# EAGLE schematic Patriot_78421-B (EAGLE 5.11)
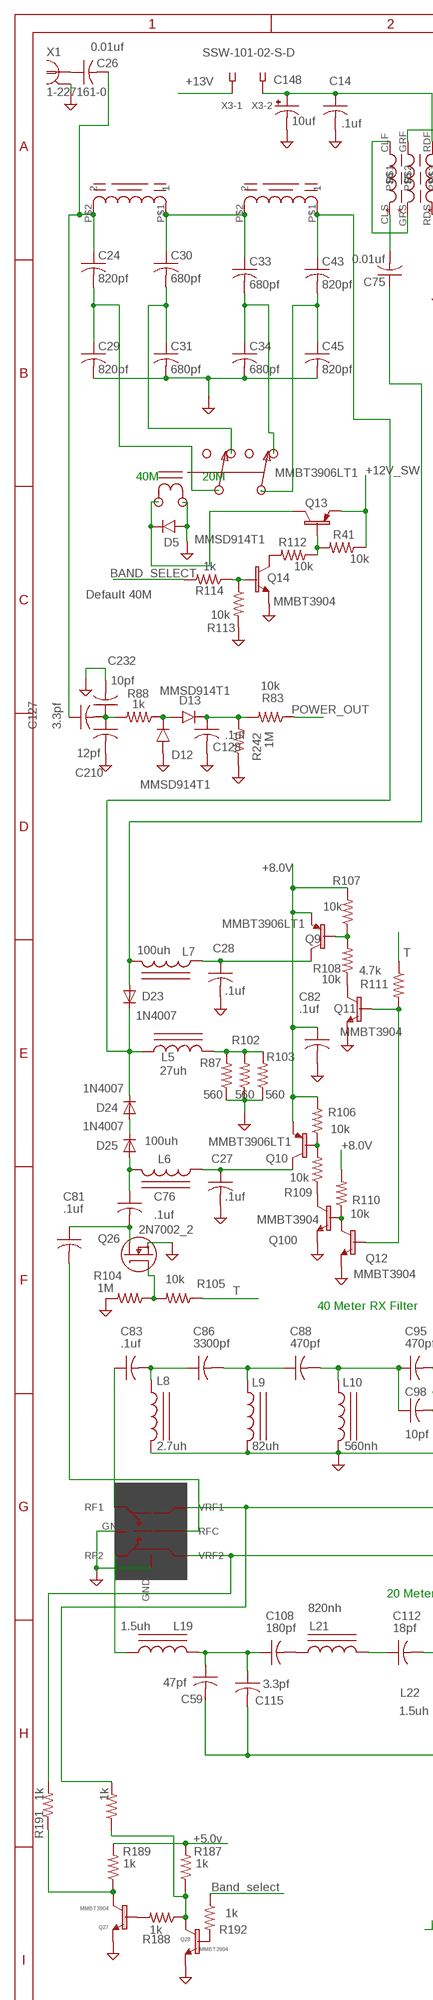
[diagram p0: schematic, sheet 1, part 1 of 2]
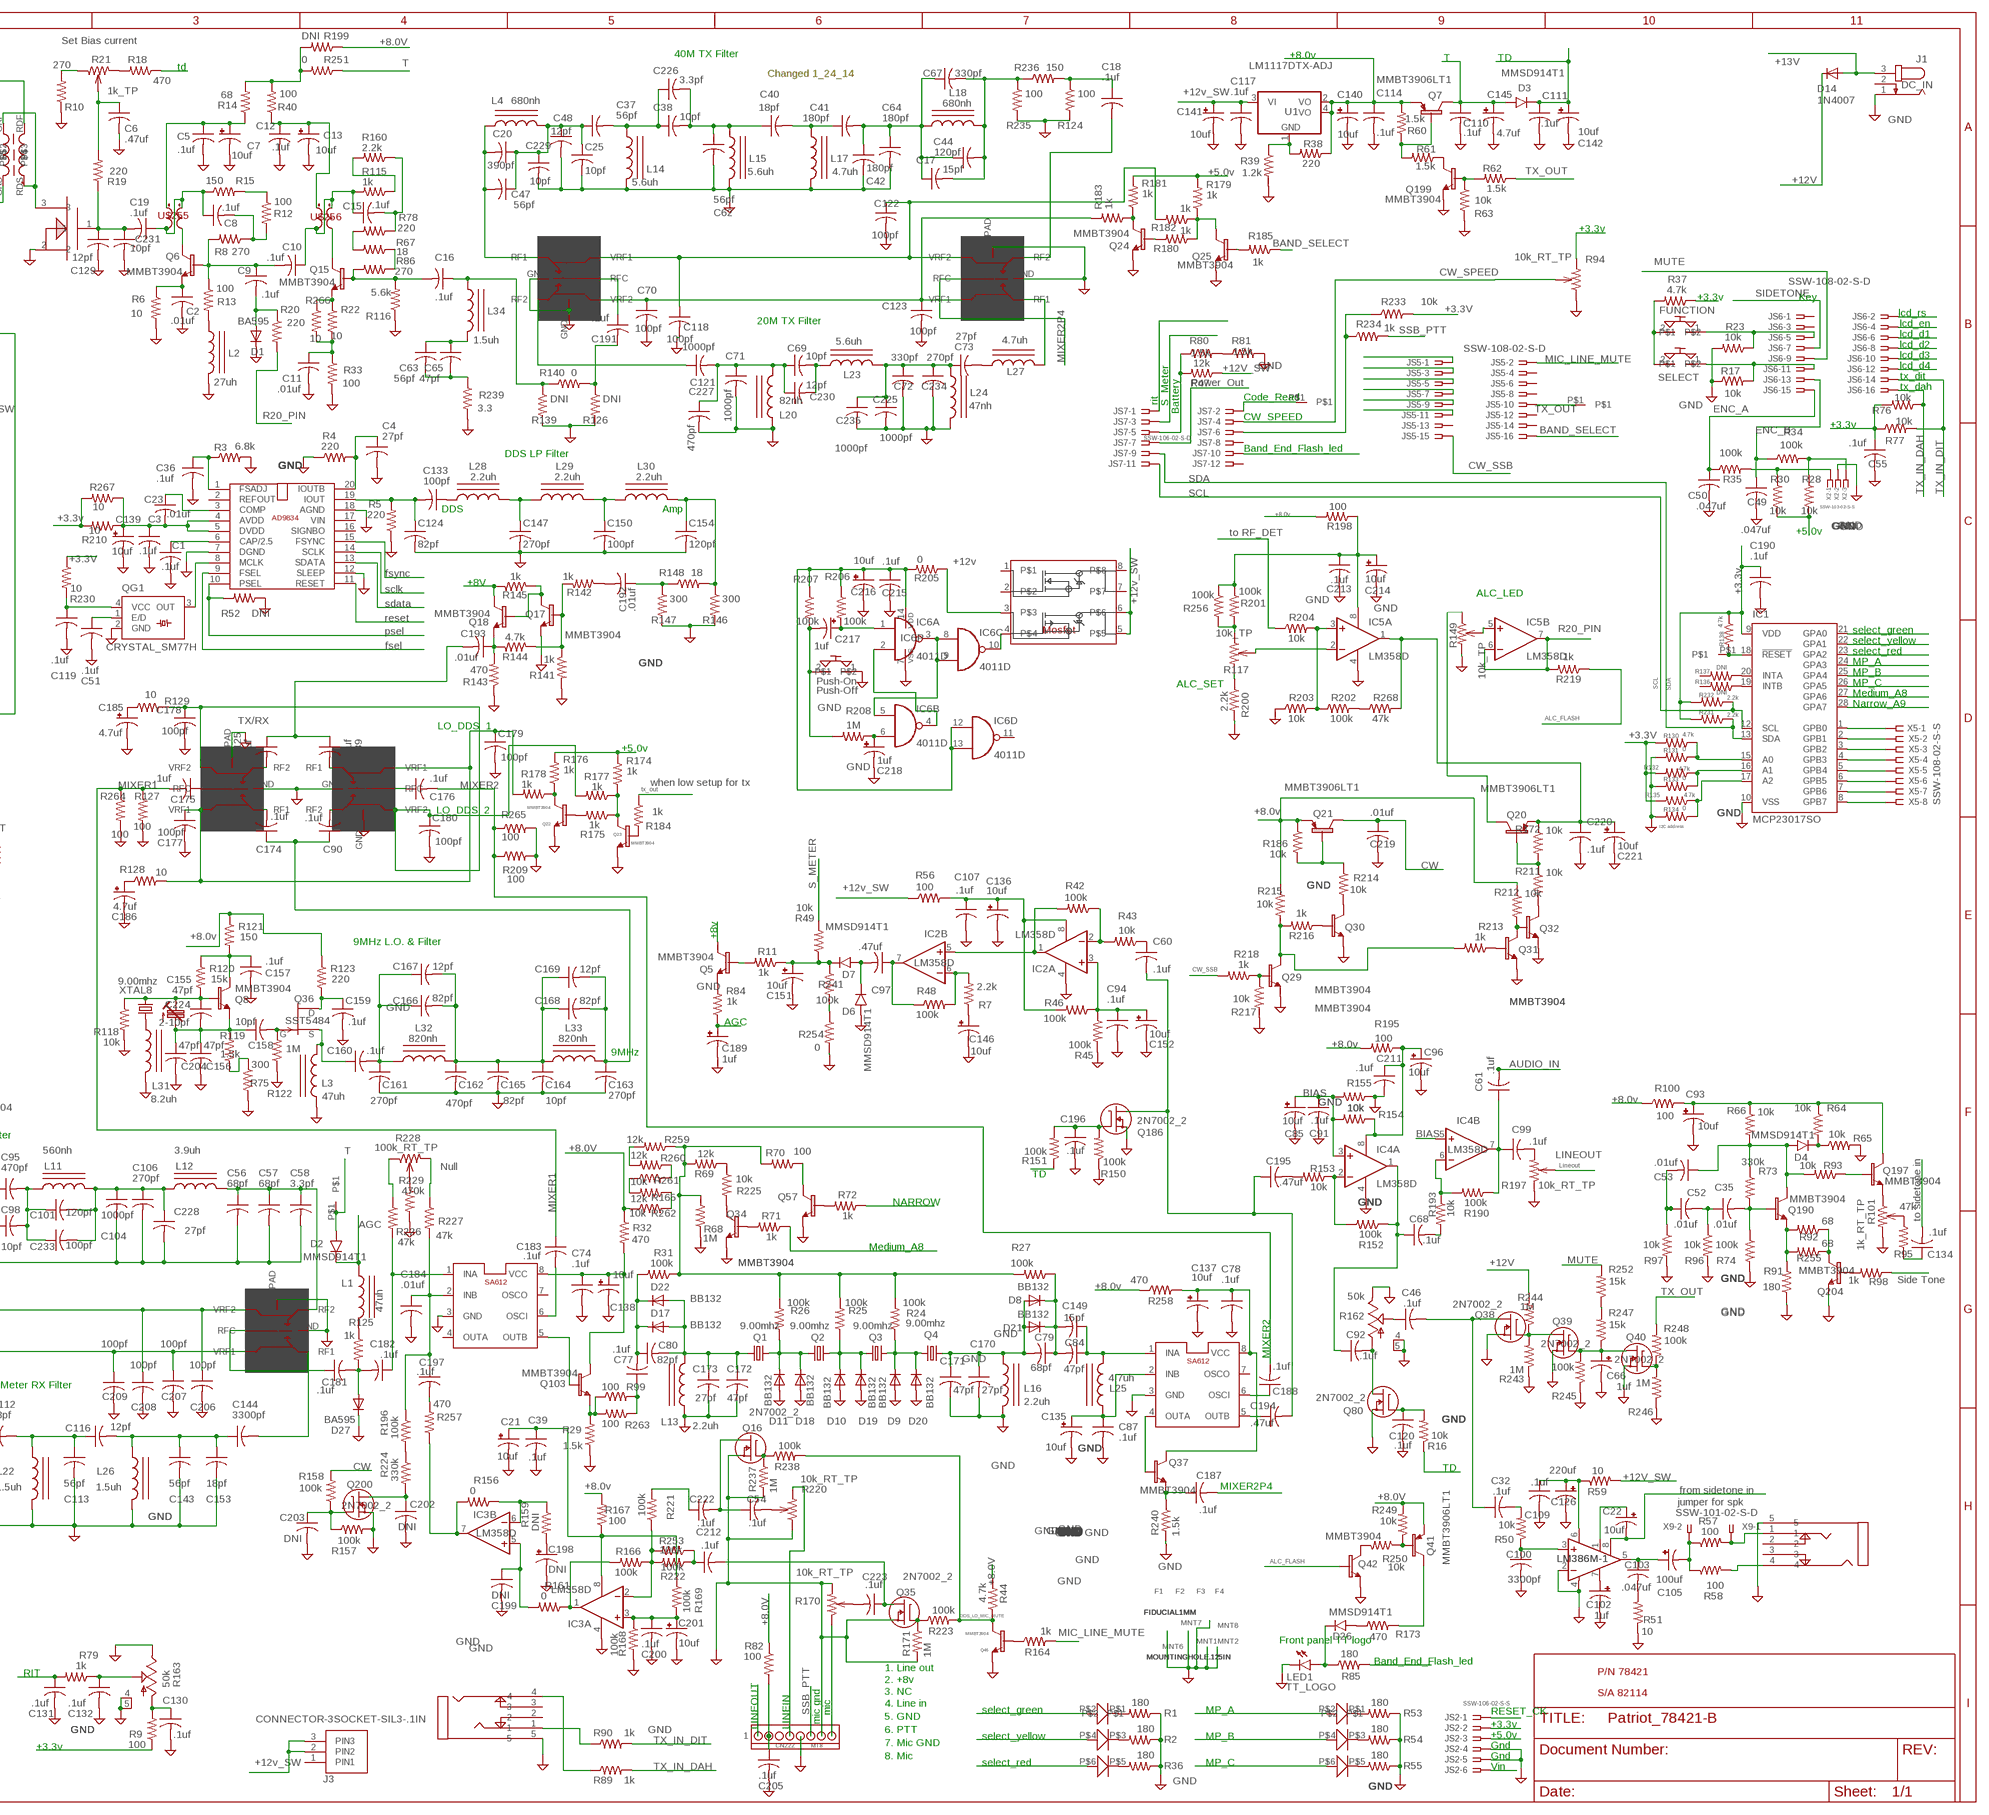
[diagram p1: schematic, sheet 1, part 2 of 2]

## Parts
C1  .1uf  CAP0603  [0603]
C2  .01uf  CAP0603  [0603]
C3  .1uf  CAP0603  [0603]
C4  27pf  CAP0603  [0603]
C5  .1uf  CAP0603  [0603]
C6  .47uf  CAP0805  [0805]
C7  10uf  CPOL-USSMCA  [SMC_A]
C8  .1uf  CAP0603  [0603]
C9  .1uf  CAP0603  [0603]
C10  .1uf  CAP0603  [0603]
C11  .01uf  CAP0603  [0603]
C12  .1uf  CAP0603  [0603]
C13  10uf  CPOL-USSMCA  [SMC_A]
C14  .1uf  CAP0603  [0603]
C15  .1uf  CAP0603  [0603]
C16  .1uf  CAP0603  [0603]
C17  15pf  CAP0805  [0805]
C18  .1uf  CAP0603  [0603]
C19  .1uf  CAP0603  [0603]
C20  390pf  CAP0603  [0603]
C21  10uf  CPOL-USSMCA  [SMC_A]
C22  10uf  CPOL-USSMCA  [SMC_A]
C23  .01uf  CAP0603  [0603]
C24  820pf  C-USC1206K  [C1206K]
C25  10pf  CAP0603  [0603]
C26  0.01uf  C-USC1206K  [C1206K]
C27  .1uf  CAP0603  [0603]
C28  .1uf  CAP0603  [0603]
C29  820pf  C-USC1206K  [C1206K]
C30  680pf  C-USC1206K  [C1206K]
C31  680pf  C-USC1206K  [C1206K]
C32  .1uf  CAP0603  [0603]
C33  680pf  C-USC1206K  [C1206K]
C34  680pf  C-USC1206K  [C1206K]
C35  .01uf  CAP0603  [0603]
C36  .1uf  CAP0603  [0603]
C37  56pf  CAP0603  [0603]
C38  10pf  CAP0603  [0603]
C39  .1uf  CAP0603  [0603]
C40  18pf  CAP0603  [0603]
C41  180pf  CAP0603  [0603]
C42  180pf  CAP0603  [0603]
C43  820pf  C-USC1206K  [C1206K]
C44  120pf  CAP0603  [0603]
C45  820pf  C-USC1206K  [C1206K]
C46  .1uf  CAP0603  [0603]
C47  56pf  CAP0603  [0603]
C48  12pf  CAP0603  [0603]
C49  .047uf  CAP0603  [0603]
C50  .047uf  CAP0603  [0603]
C51  .1uf  CAP0603  [0603]
C52  .01uf  CAP0603  [0603]
C53  .01uf  CAP0603  [0603]
C54  .1uf  CAP0603  [0603]
C55  .1uf  CAP0603  [0603]
C56  68pf  CAP0603  [0603]
C57  68pf  CAP0603  [0603]
C58  3.3pf  CAP0603  [0603]
C59  47pf  CAP0603  [0603]
C60  .1uf  CAP0603  [0603]
C61  .1uf  CAP0603  [0603]
C62  56pf  CAP0603  [0603]
C63  56pf  CAP0603  [0603]
C64  180pf  CAP0603  [0603]
C65  47pf  CAP0603  [0603]
C66  1uf  CPOL-USSMCA  [SMC_A]
C67  330pf  CAP0603  [0603]
C68  .1uf  CAP0603  [0603]
C69  10pf  CAP0603  [0603]
C70  100pf  CAP0603  [0603]
C71  1000pf  CAP0603  [0603]
C72  330pf  CAP0603  [0603]
C73  27pf  CAP0603  [0603]
C74  .1uf  CAP0603  [0603]
C75  0.01uf  C-USC1206K  [C1206K]
C76  .1uf  CAP0603  [0603]
C77  .1uf  CAP0603  [0603]
C78  .1uf  CAP0603  [0603]
C79  68pf  CAP0603  [0603]
C80  82pf  CAP0603  [0603]
C81  .1uf  CAP0603  [0603]
C82  .1uf  CAP0603  [0603]
C83  .1uf  CAP0603  [0603]
C84  47pf  CAP0603  [0603]
C85  10uf  CPOL-USSMCA  [SMC_A]
C86  3300pf  CAP0603  [0603]
C87  .1uf  CAP0603  [0603]
C88  470pf  CAP0603  [0603]
C89  .1uf  CAP0603  [0603]
C90  .1uf  CAP0603  [0603]
C91  .1uf  CAP0603  [0603]
C92  .1uf  CAP0603  [0603]
C93  10uf  CPOL-USSMCA  [SMC_A]
C94  .1uf  CAP0603  [0603]
C95  470pf  CAP0603  [0603]
C96  10uf  CPOL-USSMCA  [SMC_A]
C97  .47uf  CAP0805  [0805]
C98  10pf  CAP0603  [0603]
C99  .1uf  CAP0603  [0603]
C100  3300pf  CAP0603  [0603]
C101  120pf  CAP0603  [0603]
C102  1uf  CPOL-USSMCA  [SMC_A]
C103  .047uf  CAP0603  [0603]
C104  1000pf  CAP0603  [0603]
C105  100uf  CAP-POL7343  [POL-7343]
C106  270pf  CAP0603  [0603]
C107  .1uf  CAP0603  [0603]
C108  180pf  CAP0603  [0603]
C109  .1uf  CAP0603  [0603]
C110  .1uf  CAP0603  [0603]
C111  .1uf  CAP0603  [0603]
C112  18pf  CAP0603  [0603]
C113  56pf  CAP0603  [0603]
C114  .1uf  CAP0603  [0603]
C115  3.3pf  CAP0603  [0603]
C116  12pf  CAP0603  [0603]
C117  .1uf  CAP0603  [0603]
C118  100pf  CAP0603  [0603]
C119  .1uf  CAP0603  [0603]
C120  .1uf  CAP0603  [0603]
C121  1000pf  CAP0603  [0603]
C122  100pf  CAP0603  [0603]
C123  100pf  CAP0603  [0603]
C124  82pf  CAP0603  [0603]
C125  .1uf  CAP0603  [0603]
C126  220uf  CAP-POL7343  [POL-7343]
C127  3.3pf  CAP0603  [0603]
C128  .1uf  CAP0603  [0603]
C129  12pf  CAP0603  [0603]
C130  .1uf  CAP0603  [0603]
C131  .1uf  CAP0603  [0603]
C132  .1uf  CAP0603  [0603]
C133  100pf  CAP0603  [0603]
C134  .1uf  CAP0603  [0603]
C135  10uf  CPOL-USSMCA  [SMC_A]
C136  10uf  CPOL-USSMCA  [SMC_A]
C137  10uf  CPOL-USSMCA  [SMC_A]
C138  10uf  CPOL-USSMCA  [SMC_A]
C139  10uf  CPOL-USSMCA  [SMC_A]
C140  10uf  CPOL-USSMCA  [SMC_A]
C141  10uf  CPOL-USSMCA  [SMC_A]
C142  10uf  CPOL-USSMCA  [SMC_A]
C143  56pf  CAP0603  [0603]
C144  3300pf  CAP0603  [0603]
C145  4.7uf  CPOL-USSMCA  [SMC_A]
C146  10uf  CPOL-USSMCA  [SMC_A]
C147  270pf  CAP0603  [0603]
C148  10uf  CPOL-USSMCA  [SMC_A]
C149  15pf  CAP0805  [0805]
C150  100pf  CAP0603  [0603]
C151  10uf  CPOL-USSMCA  [SMC_A]
C152  10uf  CPOL-USSMCA  [SMC_A]
C153  18pf  CAP0603  [0603]
C154  120pf  CAP0603  [0603]
C155  47pf  CAP0603  [0603]
C156  47pf  CAP0603  [0603]
C157  .1uf  CAP0603  [0603]
C158  10pf  CAP0603  [0603]
C159  .1uf  CAP0603  [0603]
C160  .1uf  CAP0603  [0603]
C161  270pf  CAP0603  [0603]
C162  470pf  CAP0603  [0603]
C163  270pf  CAP0603  [0603]
C164  10pf  CAP0603  [0603]
C165  82pf  CAP0603  [0603]
C166  82pf  CAP0603  [0603]
C167  12pf  CAP0603  [0603]
C168  82pf  CAP0603  [0603]
C169  12pf  CAP0603  [0603]
C170  27pf  CAP0603  [0603]
C171  47pf  CAP0603  [0603]
C172  47pf  CAP0603  [0603]
C173  27pf  CAP0603  [0603]
C174  .1uf  CAP0603  [0603]
C175  .1uf  CAP0603  [0603]
C176  .1uf  CAP0603  [0603]
C177  100pf  CAP0603  [0603]
C178  100pf  CAP0603  [0603]
C179  100pf  CAP0603  [0603]
C180  100pf  CAP0603  [0603]
C181  .1uf  CAP0603  [0603]
C182  .1uf  CAP0603  [0603]
C183  .1uf  CAP0603  [0603]
C184  .01uf  CAP0603  [0603]
C185  4.7uf  CPOL-USSMCA  [SMC_A]
C186  4.7uf  CPOL-USSMCA  [SMC_A]
C187  .1uf  CAP0603  [0603]
C188  .1uf  CAP0603  [0603]
C189  1uf  CPOL-USSMCA  [SMC_A]
C190  .1uf  CAP0603  [0603]
C191  .1uf  CAP0603  [0603]
C192  .01uf  CAP0603  [0603]
C193  .01uf  CAP0603  [0603]
C194  .47uf  CAP0805  [0805]
C195  .47uf  CAP0805  [0805]
C196  .1uf  CAP0603  [0603]
C197  .1uf  CAP0603  [0603]
C198  DNI  CPOL-USSMCA  [SMC_A]
C199  DNI  CAP0603  [0603]
C200  .1uf  CAP0603  [0603]
C201  10uf  CPOL-USSMCA  [SMC_A]
C202  DNI  CAP0603  [0603]
C203  DNI  CAP0603  [0603]
C204  47pf  CAP0603  [0603]
C205  .1uf  CAP0603  [0603]
C206  100pf  CAP0603  [0603]
C207  100pf  CAP0603  [0603]
C208  100pf  CAP0603  [0603]
C209  100pf  CAP0603  [0603]
C210  12pf  CAP0603  [0603]
C211  .1uf  CAP0603  [0603]
C212  .1uf  CAP0603  [0603]
C213  .1uf  CAP0603  [0603]
C214  10uf  CPOL-USSMCA  [SMC_A]
C215  .1uf  CAP0603  [0603]
C216  10uf  CPOL-USSMCA  [SMC_A]
C217  1uf  CPOL-USSMCA  [SMC_A]
C218  1uf  CPOL-USSMCA  [SMC_A]
C219  .01uf  CAP0603  [0603]
C220  .1uf  CAP0603  [0603]
C221  10uf  CPOL-USSMCA  [SMC_A]
C222  .1uf  CAP0603  [0603]
C223  .1uf  CAP0603  [0603]
C224  2-10pf  C-TRIMMCTZ3  [CTRIMCTZ3]
C225  1000pf  CAP0603  [0603]
C226  3.3pf  CAP0603  [0603]
C227  470pf  CAP0603  [0603]
C228  27pf  CAP0603  [0603]
C229  10pf  CAP0603  [0603]
C230  12pf  CAP0603  [0603]
C231  10pf  CAP0603  [0603]
C232  10pf  CAP0603  [0603]
C233  100pf  CAP0603  [0603]
C234  270pf  CAP0603  [0603]
C235  1000pf  CAP0603  [0603]
CN222  MT8  [MT8]
D1  BA595  DIODE-SOD323-W  [SOD323-W]
D2  MMSD914T1  [SOD123]
D3  MMSD914T1  [SOD123]
D4  MMSD914T1  [SOD123]
D5  MMSD914T1  [SOD123]
D6  MMSD914T1  [SOD123]
D7  MMSD914T1  [SOD123]
D8  BB132  DIODE-SOD323-R  [SOD323-R]
D9  BB132  DIODE-SOD323-R  [SOD323-R]
D10  BB132  DIODE-SOD323-R  [SOD323-R]
D11  BB132  DIODE-SOD323-R  [SOD323-R]
D12  MMSD914T1  [SOD123]
D13  MMSD914T1  [SOD123]
D14  1N4007  DIODE-SMB  [SMB]
D17  BB132  DIODE-SOD323-R  [SOD323-R]
D18  BB132  DIODE-SOD323-R  [SOD323-R]
D19  BB132  DIODE-SOD323-R  [SOD323-R]
D20  BB132  DIODE-SOD323-R  [SOD323-R]
D21  BB132  DIODE-SOD323-R  [SOD323-R]
D22  BB132  DIODE-SOD323-R  [SOD323-R]
D23  1N4007  DIODE-SMB  [SMB]
D24  1N4007  DIODE-SMB  [SMB]
D25  1N4007  DIODE-SMB  [SMB]
D26  MMSD914T1  [SOD123]
D27  BA595  DIODE-SOD323-W  [SOD323-W]
F1  FIDUCIAL1MM  [FIDUCIAL-1MM]
F2  FIDUCIAL1MM  [FIDUCIAL-1MM]
F3  FIDUCIAL1MM  [FIDUCIAL-1MM]
F4  FIDUCIAL1MM  [FIDUCIAL-1MM]
IC1  MCP23017SO  [SO28W]
IC2  LM358D  [SO08]
IC3  LM358D  [SO08]
IC4  LM358D  [SO08]
IC5  LM358D  [SO08]
IC6  4011D  [SO14]
J1  DC_IN  JACK-PLUG0  [SPC4077]
J3  CONNECTOR-3SOCKET-SIL3-.1IN  [SOCKET-1X3-.1IN]
JS2  SSW-106-02-S-S  [SSW-106-02-S-S]
JS5  SSW-108-02-S-D  [SSW-108-02-S-D]
JS6  SSW-108-02-S-D  [SSW-108-02-S-D]
JS7  SSW-106-02-S-D  [SSW-106-02-S-D]
L1  47uh  INDUCTOR1206  [1206]
L2  27uh  INDUCTOR1206  [1206]
L3  47uh  INDUCTOR1206  [1206]
L4  680nh  INDUCTOR1206  [1206]
L5  27uh  INDUCTOR1206  [1206]
L6  100uh  INDUCTOR1206  [1206]
L7  100uh  INDUCTOR1206  [1206]
L8  2.7uh  INDUCTOR1206  [1206]
L9  82uh  INDUCTOR1206  [1206]
L10  560nh  INDUCTOR1206  [1206]
L11  560nh  INDUCTOR1206  [1206]
L12  3.9uh  INDUCTOR1206  [1206]
L13  2.2uh  INDUCTOR1206  [1206]
L14  5.6uh  INDUCTOR1206  [1206]
L15  5.6uh  INDUCTOR1206  [1206]
L16  2.2uh  INDUCTOR1206  [1206]
L17  4.7uh  INDUCTOR1206  [1206]
L18  680nh  INDUCTOR1206  [1206]
L19  1.5uh  INDUCTOR1206  [1206]
L20  82nh  INDUCTOR1206  [1206]
L21  820nh  INDUCTOR1206  [1206]
L22  1.5uh  INDUCTOR1206  [1206]
L23  5.6uh  INDUCTOR1206  [1206]
L24  47nh  INDUCTOR1206  [1206]
L25  4.7uh  INDUCTOR1206  [1206]
L26  1.5uh  INDUCTOR1206  [1206]
L27  4.7uh  INDUCTOR1206  [1206]
L28  2.2uh  INDUCTOR1206  [1206]
L29  2.2uh  INDUCTOR1206  [1206]
L30  2.2uh  INDUCTOR1206  [1206]
L31  8.2uh  INDUCTOR1206  [1206]
L32  820nh  INDUCTOR1206  [1206]
L33  820nh  INDUCTOR1206  [1206]
L34  1.5uh  INDUCTOR1206  [1206]
LED1  TT_LOGO  LED.1IN  [LED-.1IN]
LM386M-1  LM386M-1  [SO08]
MNT1  MOUNTINGHOLE.125IN  [MOUNTINGHOLE-.125IN]
MNT2  MOUNTINGHOLE.125IN  [MOUNTINGHOLE-.125IN]
MNT6  MOUNTINGHOLE.125IN  [MOUNTINGHOLE-.125IN]
MNT7  MOUNTINGHOLE.125IN  [MOUNTINGHOLE-.125IN]
MNT8  MOUNTINGHOLE.125IN  [MOUNTINGHOLE-.125IN]
P1  PAD  [PAD]
Q1  9.00mhz  CRYSTALSM49  [SM49]
Q2  9.00mhz  CRYSTALSM49  [SM49]
Q3  9.00mhz  CRYSTALSM49  [SM49]
Q4  9.00mhz  CRYSTALSM49  [SM49]
Q5  MMBT3904  [MIKE_SOT23]
Q6  MMBT3904  [MIKE_SOT23]
Q7  MMBT3906LT1  [SOT23]
Q8  MMBT3904  [MIKE_SOT23]
Q9  MMBT3906LT1  [SOT23]
Q10  MMBT3906LT1  [SOT23]
Q11  MMBT3904  [MIKE_SOT23]
Q12  MMBT3904  [MIKE_SOT23]
Q13  MMBT3906LT1  [SOT23]
Q14  MMBT3904  [MIKE_SOT23]
Q15  MMBT3904  [MIKE_SOT23]
Q16  2N7002_2  [SOT-23]
Q17  MMBT3904  [MIKE_SOT23]
Q18  MMBT3904  [MIKE_SOT23]
Q20  MMBT3906LT1  [SOT23]
Q21  MMBT3906LT1  [SOT23]
Q22  MMBT3904  [MIKE_SOT23]
Q23  MMBT3904  [MIKE_SOT23]
Q24  MMBT3904  [MIKE_SOT23]
Q25  MMBT3904  [MIKE_SOT23]
Q26  2N7002_2  [SOT-23]
Q27  MMBT3904  [MIKE_SOT23]
Q28  MMBT3904  [MIKE_SOT23]
Q29  MMBT3904  [MIKE_SOT23]
Q30  MMBT3904  [MIKE_SOT23]
Q31  MMBT3904  [MIKE_SOT23]
Q32  MMBT3904  [MIKE_SOT23]
Q34  MMBT3904  [MIKE_SOT23]
Q35  2N7002_2  [SOT-23]
Q36  SST5484  [SOT23]
Q37  MMBT3904  [MIKE_SOT23]
Q38  2N7002_2  [SOT-23]
Q39  2N7002_2  [SOT-23]
Q40  2N7002_2  [SOT-23]
Q41  MMBT3906LT1  [SOT23]
Q42  MMBT3904  [MIKE_SOT23]
Q46  MMBT3904  [MIKE_SOT23]
Q57  MMBT3904  [MIKE_SOT23]
Q80  2N7002_2  [SOT-23]
Q100  MMBT3904  [MIKE_SOT23]
Q103  MMBT3904  [MIKE_SOT23]
Q186  2N7002_2  [SOT-23]
Q190  MMBT3904  [MIKE_SOT23]
Q197  MMBT3904  [MIKE_SOT23]
Q199  MMBT3904  [MIKE_SOT23]
Q200  2N7002_2  [SOT-23]
Q204  MMBT3904  [MIKE_SOT23]
QG1  CRYSTAL_SM77H  [CRYSTAL_SM77H]
R1  180  RESISTOR0603  [0603]
R2  180  RESISTOR0603  [0603]
R3  6.8k  R-US_R0805  [R0805]
R4  220  RESISTOR0603  [0603]
R5  220  RESISTOR0603  [0603]
R6  10  RESISTOR0603  [0603]
R7  2.2k  RESISTOR0603  [0603]
R8  270  RESISTOR0603  [0603]
R9  100  RESISTOR0603  [0603]
R10  270  RESISTOR0603  [0603]
R11  1k  RESISTOR0603  [0603]
R12  100  RESISTOR0603  [0603]
R13  100  RESISTOR0603  [0603]
R14  68  RESISTOR0603  [0603]
R15  150  RESISTOR0603  [0603]
R16  10k  RESISTOR0603  [0603]
R17  10k  RESISTOR0603  [0603]
R18  470  RESISTOR0603  [0603]
R19  220  RESISTOR0603  [0603]
R20  220  RESISTOR0603  [0603]
R21  1k_TP  RES-VAR104-M-HOR  [RVM-06-HP03-1]
R22  10  RESISTOR0603  [0603]
R23  10k  RESISTOR0603  [0603]
R24  100k  RESISTOR0603  [0603]
R25  100k  RESISTOR0603  [0603]
R26  100k  RESISTOR0603  [0603]
R27  100k  RESISTOR0603  [0603]
R28  10k  RESISTOR0603  [0603]
R29  1.5k  RESISTOR0603  [0603]
R30  10k  RESISTOR0603  [0603]
R31  100k  RESISTOR0603  [0603]
R32  470  RESISTOR0603  [0603]
R33  100  RESISTOR0603  [0603]
R34  100k  RESISTOR0603  [0603]
R35  100k  RESISTOR0603  [0603]
R36  180  RESISTOR0603  [0603]
R37  4.7k  RESISTOR0603  [0603]
R38  220  RESISTOR0603  [0603]
R39  1.2k  RESISTOR0603  [0603]
R40  100  RESISTOR0603  [0603]
R41  10k  RESISTOR0603  [0603]
R42  100k  RESISTOR0603  [0603]
R43  10k  RESISTOR0603  [0603]
R44  4.7k  RESISTOR0603  [0603]
R45  100k  RESISTOR0603  [0603]
R46  100k  RESISTOR0603  [0603]
R47  12k  RESISTOR0805  [0805]
R48  100k  RESISTOR0603  [0603]
R49  10k  RESISTOR0603  [0603]
R50  10k  RESISTOR0603  [0603]
R51  10  RESISTOR0603  [0603]
R52  DNI  RESISTOR0603  [0603]
R53  180  RESISTOR0603  [0603]
R54  180  RESISTOR0603  [0603]
R55  180  RESISTOR0603  [0603]
R56  100  RESISTOR0603  [0603]
R57  100  RESISTOR0603  [0603]
R58  100  RESISTOR0603  [0603]
R59  10  RESISTOR0603  [0603]
R60  1.5k  RESISTOR0603  [0603]
R61  1.5k  RESISTOR0603  [0603]
R62  1.5k  RESISTOR0603  [0603]
R63  10k  RESISTOR0603  [0603]
R64  10k  RESISTOR0603  [0603]
R65  10k  RESISTOR0603  [0603]
R66  10k  RESISTOR0603  [0603]
R67  18  RESISTOR0805  [0805]
R68  1M  RESISTOR0603  [0603]
R69  12k  RESISTOR0805  [0805]
R70  100  RESISTOR0603  [0603]
R71  1k  RESISTOR0603  [0603]
R72  1k  RESISTOR0603  [0603]
R73  330k  RESISTOR0603  [0603]
R74  100k  RESISTOR0603  [0603]
R75  300  RESISTOR0805  [0805]
R76  10k  RESISTOR0603  [0603]
R77  10k  RESISTOR0603  [0603]
R78  220  RESISTOR0603  [0603]
R79  1k  RESISTOR0603  [0603]
R80  1.5k  RESISTOR0603  [0603]
R81  1.5k  RESISTOR0603  [0603]
R82  100  RESISTOR0603  [0603]
R83  10k  RESISTOR0603  [0603]
R84  1k  RESISTOR0603  [0603]
R85  180  RESISTOR0603  [0603]
R86  270  RESISTOR0603  [0603]
R87  560  RESISTOR0805  [0805]
R88  1k  RESISTOR0603  [0603]
R89  1k  RESISTOR0603  [0603]
R90  1k  RESISTOR0603  [0603]
R91  180  RESISTOR0603  [0603]
R92  68  RESISTOR0603  [0603]
R93  10k  RESISTOR0603  [0603]
R94  10k_RT_TP  RES-VAR104-M-VERT  [RVM-06-VP01-1]
R95  47k  RESISTOR0805  [0805]
R96  10k  RESISTOR0603  [0603]
R97  10k  RESISTOR0603  [0603]
R98  1k  RESISTOR0603  [0603]
R99  100  RESISTOR0603  [0603]
R100  100  RESISTOR0603  [0603]
R101  1k_RT_TP  RES-VAR104-M-VERT  [RVM-06-VP01-1]
R102  560  RESISTOR0805  [0805]
R103  560  RESISTOR0805  [0805]
R104  1M  RESISTOR0603  [0603]
R105  10k  RESISTOR0603  [0603]
R106  10k  RESISTOR0603  [0603]
R107  10k  RESISTOR0603  [0603]
R108  10k  RESISTOR0603  [0603]
R109  10k  RESISTOR0603  [0603]
R110  10k  RESISTOR0603  [0603]
R111  4.7k  RESISTOR0603  [0603]
R112  10k  RESISTOR0603  [0603]
R113  10k  RESISTOR0603  [0603]
R114  1k  RESISTOR0603  [0603]
R115  1k  RESISTOR0603  [0603]
R116  5.6k  RESISTOR0805  [0805]
R117  10k_TP  RES-VAR104-M-HOR  [RVM-06-HP03-1]
R118  10k  RESISTOR0603  [0603]
R119  1.5k  RESISTOR0603  [0603]
R120  15k  RESISTOR0805  [0805]
R121  150  RESISTOR0603  [0603]
R122  1M  RESISTOR0603  [0603]
R123  220  RESISTOR0603  [0603]
R124  100  RESISTOR0603  [0603]
R125  1k  RESISTOR0603  [0603]
R126  DNI  RESISTOR0603  [0603]
R127  100  RESISTOR0603  [0603]
R128  10  RESISTOR0603  [0603]
R129  10  RESISTOR0603  [0603]
R130  4.7k  RESISTOR0603  [0603]
R131  0  RESISTOR0603  [0603]
R132  4.7k  RESISTOR0603  [0603]
R133  0  RESISTOR0603  [0603]
R134  0  RESISTOR0603  [0603]
R135  4.7k  RESISTOR0603  [0603]
R136  DNI  RESISTOR0603  [0603]
R137  DNI  RESISTOR0603  [0603]
R138  4.7k  RESISTOR0603  [0603]
R139  DNI  RESISTOR0603  [0603]
R140  0  RESISTOR0603  [0603]
R141  1k  RESISTOR0603  [0603]
R142  1k  RESISTOR0603  [0603]
R143  470  RESISTOR0603  [0603]
R144  4.7k  RESISTOR0603  [0603]
R145  1k  RESISTOR0603  [0603]
R146  300  RESISTOR0805  [0805]
R147  300  RESISTOR0805  [0805]
R148  18  RESISTOR0805  [0805]
R149  10k_TP  RES-VAR104-M-HOR  [RVM-06-HP03-1]
R150  100k  RESISTOR0603  [0603]
R151  100k  RESISTOR0603  [0603]
R152  100k  RESISTOR0603  [0603]
R153  10k  RESISTOR0603  [0603]
R154  10k  RESISTOR0603  [0603]
R155  10k  RESISTOR0603  [0603]
R156  0  RESISTOR0603  [0603]
R157  100k  RESISTOR0603  [0603]
R158  100k  RESISTOR0603  [0603]
R159  DNI  RESISTOR0603  [0603]
R160  2.2k  RESISTOR0603  [0603]
R161  0  RESISTOR0603  [0603]
R162  50k  EVUE25POT  [3RP/1610N]
R163  50k  EVUE25POT  [3RP/1610N]
R164  1k  RESISTOR0603  [0603]
R165  12k  RESISTOR0805  [0805]
R166  100k  RESISTOR0603  [0603]
R167  100  RESISTOR0603  [0603]
R168  100k  RESISTOR0603  [0603]
R169  100k  RESISTOR0603  [0603]
R170  10k_RT_TP  RES-VAR104-M-VERT  [RVM-06-VP01-1]
R171  1M  RESISTOR0603  [0603]
R172  10k  RESISTOR0603  [0603]
R173  470  RESISTOR0603  [0603]
R174  1k  RESISTOR0603  [0603]
R175  1k  RESISTOR0603  [0603]
R176  1k  RESISTOR0603  [0603]
R177  1k  RESISTOR0603  [0603]
R178  1k  RESISTOR0603  [0603]
R179  1k  RESISTOR0603  [0603]
R180  1k  RESISTOR0603  [0603]
R181  1k  RESISTOR0603  [0603]
R182  1k  RESISTOR0603  [0603]
R183  1k  RESISTOR0603  [0603]
R184  1k  RESISTOR0603  [0603]
R185  1k  RESISTOR0603  [0603]
R186  10k  RESISTOR0603  [0603]
R187  1k  RESISTOR0603  [0603]
R188  1k  RESISTOR0603  [0603]
R189  1k  RESISTOR0603  [0603]
R190  100k  RESISTOR0603  [0603]
R191  1k  RESISTOR0603  [0603]
R192  1k  RESISTOR0603  [0603]
R193  10k  RESISTOR0603  [0603]
R194  1k  RESISTOR0603  [0603]
R195  100  RESISTOR0603  [0603]
R196  100k  RESISTOR0603  [0603]
R197  10k_RT_TP  RES-VAR104-M-VERT  [RVM-06-VP01-1]
R198  100  RESISTOR0603  [0603]
R199  DNI  RESISTOR0603  [0603]
R200  2.2k  RESISTOR0603  [0603]
R201  100k  RESISTOR0603  [0603]
R202  100k  RESISTOR0603  [0603]
R203  10k  RESISTOR0603  [0603]
R204  10k  RESISTOR0603  [0603]
R205  0  RESISTOR0603  [0603]
R206  100k  RESISTOR0603  [0603]
R207  100k  RESISTOR0603  [0603]
R208  1M  RESISTOR0603  [0603]
R209  100  RESISTOR0603  [0603]
R210  10  RESISTOR0603  [0603]
R211  10k  RESISTOR0603  [0603]
R212  10k  RESISTOR0603  [0603]
R213  1k  RESISTOR0603  [0603]
R214  10k  RESISTOR0603  [0603]
R215  10k  RESISTOR0603  [0603]
R216  1k  RESISTOR0603  [0603]
R217  10k  RESISTOR0603  [0603]
R218  1k  RESISTOR0603  [0603]
R219  1k  RESISTOR0603  [0603]
R220  10k_RT_TP  RES-VAR104-M-VERT  [RVM-06-VP01-1]
R221  100k  RESISTOR0603  [0603]
R222  100k  RESISTOR0603  [0603]
R223  100k  RESISTOR0603  [0603]
R224  330k  RESISTOR0603  [0603]
R225  10k  RESISTOR0603  [0603]
R226  47k  RESISTOR0805  [0805]
R227  47k  RESISTOR0805  [0805]
R228  100k_RT_TP  RES-VAR104-M-VERT  [RVM-06-VP01-1]
R229  470k  RESISTOR0805  [0805]
R230  10  RESISTOR0603  [0603]
R231  2.2k  RESISTOR0603  [0603]
R232  2.2k  RESISTOR0603  [0603]
R233  10k  RESISTOR0603  [0603]
R234  1k  RESISTOR0603  [0603]
R235  100  RESISTOR0603  [0603]
R236  150  RESISTOR0603  [0603]
R237  1M  RESISTOR0603  [0603]
R238  100k  RESISTOR0603  [0603]
R239  3.3  RESISTOR0805  [0805]
R240  1.5k  RESISTOR0603  [0603]
R241  100k  RESISTOR0603  [0603]
R242  1M  RESISTOR0603  [0603]
R243  1M  RESISTOR0603  [0603]
R244  1M  RESISTOR0603  [0603]
R245  100k  RESISTOR0603  [0603]
R246  1M  RESISTOR0603  [0603]
R247  15k  RESISTOR0805  [0805]
R248  100k  RESISTOR0603  [0603]
R249  10k  RESISTOR0603  [0603]
R250  10k  RESISTOR0603  [0603]
R251  0  RESISTOR0603  [0603]
R252  15k  RESISTOR0805  [0805]
R253  100k  RESISTOR0603  [0603]
R254  0  RESISTOR0603  [0603]
R255  68  RESISTOR0603  [0603]
R256  100k  RESISTOR0603  [0603]
R257  470  RESISTOR0603  [0603]
R258  470  RESISTOR0603  [0603]
R259  12k  RESISTOR0805  [0805]
R260  12k  RESISTOR0805  [0805]
R261  10k  RESISTOR0603  [0603]
R262  10k  RESISTOR0603  [0603]
R263  100  RESISTOR0603  [0603]
R264  100  RESISTOR0603  [0603]
R265  100  RESISTOR0603  [0603]
R266  10  RESISTOR0603  [0603]
R267  10  RESISTOR0603  [0603]
R268  47k  RESISTOR0805  [0805]
RD16HHF1  TO220S  [TO-220S]
TOROID1  TOROIDWHITE  TOROID  [TOROID]
TOROID2  TOROIDWHITE  TOROID  [TOROID]
U1  LM1117DTX-ADJ  [TO252]
U247  IRF7319Pbf  IRF7319PBF  [IRF7319PBF]
U$1  AD9834  [AD9834]
U$37  OUT_TRI  [OUT_TRI]
U$40  SA612  [SO08]
U$41  SA612  [SO08]
U$46  AXICOM  LEEJ_P2RELAY  [LEEJ_P2RELAY]
U$61  TACT_SWITCH  [TL1105JA]
U$72  RF1200  [RF1200]
U$73  RF1200  [RF1200]
U$75  RF1200  [RF1200]
U$76  RF1200  [RF1200]
U$80  RF1200  [RF1200]
U$81  RF1200  [RF1200]
U$143  35252R  [35252]
U$148  TACT_SWITCH  [TL1105JA]
U$154  PAD  [PAD]
U$166  GYR_LED_TL  [GYR_LED_TL]
U$168  GYR_LED_TL  [GYR_LED_TL]
U$177  PAD  [PAD]
U$184  PAD  [PAD]
U$188  35252R  [35252]
U$245  TACT_SWITCH  [TL1105JA]
U$255  BALUNBALUN_B  [BALUN]
U$256  BALUNBALUN_B  [BALUN]
X1  1-227161-0  [AMP_227161]
X2  SSW-103-02-S-S  [SSW-103-02-S-S]
X3  SSW-101-02-S-D  [SSW-101-02-S-D]
X5  SSW-108-02-S-S  [SSW-108-02-S-S]
X9  SSW-101-02-S-D  [SSW-101-02-S-D]
XTAL8  9.00mhz  CRYSTALSM49  [SM49]

## Nets
+3.3_V: C3.1 C23.2 C139.+ R210.1 R267.1 U$1.4(AVDD) U$1.5(DVDD)
+3.3V: C55.1 C190.1 IC1.9(VDD) JS2.2 R9.1 R37.1 R76.2 R77.1 R94.3 R130.2 R132.2 R135.2 R138.1 R210.2 R230.1 R231.2 R232.2 R233.2 R267.2
+5.0V: JS2.3 R28.2 R30.2 R174.2 R176.2 R179.2 R181.2 R187.2 R189.2
+8.0V: C82.1 C114.1 C140.+ Q5.3(C) Q7.2(E) Q9.2(E) Q10.2(E) Q18.3(C) Q21.2(E) Q41.2(E) R32.1 R38.1 R44.2 R60.2 R82.1 R100.1 R106.2 R107.2 R110.2 R121.1 R123.1 R145.1 R167.2 R186.1 R195.2 R198.2 R199.1 R212.1 R215.1 R249.2 R258.1 R262.1 U1.2(VO) U1.4(VO)
+12V: D14.C R205.1 R244.2 U247.3
+12V_SW: C117.1 C141.+ J3.2(PIN2) J3.3(PIN3) JS2.6 Q13.2(E) R41.1 R47.1 R56.1 R59.2 U1.3(VI) U247.5 U247.6
+13V: D14.A J1.3 X3.1
AGC: C189.+ D2.C L1.1 R84.1
ALC_FLASH: Q42.1(B) R219.1
AUDIO_IN: C61.2 JS7.2 U$184.P$1
BAND_END_FLASH_LED: JS7.10 R85.2
BAND_SELECT: JS5.16 R114.2 R185.1 R192.1
BATTERY: JS7.5 R47.2 R80.1
BIAS: C85.+ C91.1 IC4.3(A:+IN) IC4.5(B:+IN) R154.2 R155.2
BLN16: C5.1 C7.+ R14.1 U$255.P$3
CW: C219.1 Q21.3(C) R158.2
CW_SPEED: JS7.4 R94.2
CW_SSB: JS5.15 R218.2
DDS_LO_MIC_MUTE$TEST: Q46.3(C) R44.1 R223.2 R238.2
ENC_A: C50.1 JS6.15 R35.1
ENC_B: C49.1 JS6.13 R34.1
FSEL: JS5.3 U$1.9(FSEL)
FSYNC: JS5.11 U$1.15(FSYNC)
GND: C1.2 C2.2 C3.2 C4.2 C5.2 C6.2 C7.- C11.2 C12.2 C13.- C14.2 C21.- C25.2 C27.2 C28.2 C29.2 C31.2 C34.2 C36.2 C39.2 C42.2 C45.2 C48.2 C49.2 C50.2 C51.2 C55.2 C56.2 C57.2 C58.2 C59.2 C62.2 C64.2 C66.- C70.2 C71.2 C72.2 C74.2 C78.2 C82.2 C85.- C87.2 C91.2 C93.- C94.2 C96.- C100.2 C102.- C104.2 C106.2 C107.2 C109.2 C110.2 C111.2 C113.2 C114.2 C115.2 C117.2 C118.2 C119.2 C120.2 C122.2 C123.2 C124.2 C126.- C128.2 C129.2 C130.2 C131.2 C132.2 C135.- C136.- C137.- C138.- C139.- C140.- C141.- C142.- C143.2 C145.- C146.- C147.2 C148.- C150.2 C151.- C152.- C153.2 C154.2 C156.2 C157.2 C159.2 C161.2 C162.2 C163.2 C164.2 C165.2 C170.2 C171.2 C172.2 C173.2 C177.2 C178.2 C179.2 C180.2 C184.2 C185.- C186.- C189.- C190.2 C196.2 C198.- C199.2 C200.2 C201.- C202.2 C203.2 C204.2 C205.2 C206.2 C207.2 C208.2 C209.2 C210.2 C211.2 C213.2 C214.- C215.2 C216.- C218.- C219.2 C220.2 C221.- C225.2 C227.2 C228.2 C229.2 C231.2 C232.2 C234.2 C235.2 CN222.5 CN222.7 D1.C D5.A D6.A D9.A D10.A D11.A D12.A D18.A D19.A D20.A D27.C IC1.10(VSS) IC2.4(P:V-) IC3.4(P:V-) IC4.4(P:V-) IC5.4(P:V-) IC6.7(P:VSS) J1.1 JS2.4 JS2.5 L2.2 L3.1 L8.2 L9.2 L10.2 L13.2 L14.2 L15.2 L16.2 L17.2 L20.1 L22.2 L24.2 L26.2 L31.2 LED1.C LM386M-1.2(-IN) LM386M-1.4(GND) MNT1.MNT MNT2.MNT MNT6.MNT MNT7.MNT MNT8.MNT Q11.2(E) Q12.2(E) Q14.2(E) Q16.2 Q17.2(E) Q22.2(E) Q23.2(E) Q24.2(E) Q25.2(E) Q26.2 Q27.2(E) Q28.2(E) Q29.2(E) Q30.2(E) Q31.2(E) Q32.2(E) Q34.2(E) Q35.2 Q38.2 Q39.2 Q40.2 Q42.2(E) Q46.2(E) Q57.2(E) Q80.2 Q100.2(E) Q186.2 Q199.2(E) Q200.2 Q204.2(E) QG1.2(GND) R1.1 R2.1 R3.2 R4.1 R5.1 R6.2 R10.1 R17.1 R23.2 R29.1 R33.2 R36.1 R39.2 R45.2 R51.1 R52.1 R53.1 R54.1 R55.1 R63.2 R65.2 R68.1 R74.2 R75.2 R81.2 R87.1 R91.1 R94.1 R96.2 R97.2 R101.3 R102.1 R103.1 R104.2 R113.2 R116.1 R118.2 R122.1 R124.2 R126.2 R127.2 R131.2 R133.2 R134.2 R139.2 R141.2 R143.1 R146.2 R147.2 R149.3 R150.1 R155.1 R157.2 R162.1(E1) R162.4 R162.5 R163.1(E1) R163.4 R163.5 R168.2 R170.3 R171.2 R197.1 R200.2 R203.1 R209.2 R217.2 R220.1 R229.2 R235.2 R237.2 R239.2 R240.2 R242.1 R243.1 R245.1 R246.1 R254.2 R264.2 R265.2 RD16HHF1.2 U$1.7(DGND) U$1.12(SLEEP) U$1.18(AGND) U$40.3(GND) U$41.3(GND) U$46.12 U$72.GND U$72.GNDPAD U$73.GND U$73.GNDPAD U$75.GND U$75.GNDPAD U$76.GND U$76.GNDPAD U$80.GND U$80.GNDPAD U$81.GND U$81.GNDPAD U$143.5 U$188.5 U$245.1 X1.2(GND) X2.2
LCD_D1: JS6.6
LCD_D2: JS6.8
LCD_D3: JS6.10
LCD_D4: JS6.12
LCD_EN: JS6.4
LCD_RS: JS6.2
LINEOUT: CN222.1 R197.2
LO_DDS_1: C177.1 C179.1 R128.2 R178.2 U$80.VRF1 U$81.VRF1
LO_DDS_2: C178.1 C180.1 R129.2 R177.2 U$80.VRF2 U$81.VRF2
LO_DDS_3: C207.1 C209.1 R191.2 U$75.VRF2 U$76.VRF1
LO_DDS_4: C206.1 C208.1 R194.2 U$75.VRF1 U$76.VRF2
MEDIUM_A8: IC1.27(GPA6) R71.1
MIC_LINE_MUTE: JS5.2 R164.2
MIXER1: C175.2 C183.1 R127.1 R264.1
MIXER2: C176.2 C188.2 R209.1 R265.1
MIXER2P4: C187.2 U$73.RFC
MP_A: IC1.24(GPA3) U$168.P$2
MP_B: IC1.25(GPA4) U$168.P$4
MP_C: IC1.26(GPA5) U$168.P$6
MUTE: JS6.9 R252.2
N$1: C183.2 U$41.6(OSCI)
N$2: R226.1 R228.1
N$3: C154.1 L30.2 R146.1 R148.2
N$4: C191.1 U$72.RFC
N$5: C191.2 R126.1 R140.2
N$6: C36.1 R3.1 U$1.1(FSADJ)
N$7: R12.1 R15.2
N$8: C16.1 L34.1 R139.1 R140.1
N$9: C4.1 R4.2 U$1.20(IOUTB)
N$10: C1.1 U$1.6(CAP/2.5)
N$11: Q6.3(C) U$255.P$4
N$12: C9.1 C10.2 Q6.1(B) R8.2 R13.1
N$13: L2.1 R13.2
N$14: C2.1 Q6.2(E) R6.1
N$15: C9.2 D1.A R20.1
N$16: Q15.2(E) R22.1 R266.1
N$17: C8.1 C19.1 R15.1 U$255.P$1 U$255.P$2
N$18: C8.2 R8.1 R12.2
N$19: C11.1 R22.2 R33.1 R266.2
N$20: C12.1 C13.+ R40.1 U$256.P$3
N$21: C15.2 R78.1 R160.1
N$22: Q15.3(C) U$256.P$4
N$23: C10.1 C15.1 R115.2 U$256.P$1 U$256.P$2
N$24: R67.1 R86.1
N$25: C32.2 R50.2
N$26: C16.2 Q15.1(B) R86.2 R116.2
N$27: C70.1 C123.1 R183.2 U$72.VRF2 U$73.VRF1
N$28: C60.2 C194.2 C195.1 Q186.3
N$29: R30.1 R35.2 X2.1
N$30: C6.1 R19.2 R21.2
N$31: Q14.3(C) R112.2
N$32: R18.2 R21.3
N$33: R10.2 R21.1
N$34: R80.2 R81.1
N$35: U$37.CLF U$37.GRS
N$36: C119.1 QG1.4(VCC) R230.2
N$37: JS7.6 R233.1 R234.1
N$38: C76.2 C81.1 Q26.3
N$39: Q26.1 R104.1 R105.2
N$40: C73.2 L27.1
N$41: R202.2 R268.1
N$42: C69.2 C230.2 L23.1
N$43: R38.2 R39.1 U1.1(GND)
N$44: D4.C R64.2 R65.1
N$45: JS6.11 R17.2 U$148.1
N$46: C130.1 R9.2 R163.3(E2)
N$47: C93.+ Q197.3(C) R64.1 R66.1 R100.2
N$48: Q199.3(C) R61.1
N$49: C100.1 LM386M-1.3(+IN) R50.1
N$50: C35.2 Q190.1(B) R73.2 R74.1
N$51: IC5.5(B:+IN) R149.2
N$52: C19.2 C129.1 C231.1 R19.1 RD16HHF1.1
N$53: IC6.10(C:O) U247.4
N$54: R1.2 U$166.P$1
N$55: C193.1 Q18.2(E) R143.2 R144.1
N$56: C56.1 C57.1 C58.1 L12.2 U$76.RF2
N$57: C59.1 C108.1 C115.1 L19.2
N$58: C220.1 C221.+ IC5.1(A:OUT) Q20.2(E) R172.1 R268.2
N$59: Q17.3(C) Q18.1(B) R145.2
N$60: C192.2 R142.1
N$61: C192.1 R147.1 R148.1
N$62: C20.2 C47.2 L4.1 U$72.RF1
N$63: C20.1 C25.1 C37.1 C47.1 C48.1 C229.1 L4.2
N$64: C26.1 X1.1
N$65: C80.2 C172.1 C173.1 D17.A D22.A L13.1 Q1.1
N$66: Q103.1(B) U$41.5(OUTB)
N$67: Q103.2(E) R29.2 R99.1 R263.2
N$68: C74.1 C138.+ Q103.3(C) R32.2 U$41.8(VCC)
N$69: Q41.1(B) R249.1 R250.1
N$70: C127.2 C210.1 C232.1 R88.2
N$71: D9.C D20.C Q3.2 Q4.1 R24.1
N$72: C35.1 C52.2 R96.1
N$73: D11.C D18.C Q1.2 Q2.1 R26.1
N$74: C79.2 C170.1 C171.1 D8.A D21.A L16.1 Q4.2
N$75: C61.1 C99.1 IC4.7(B:OUT) R190.1
N$76: C79.1 C84.2 C149.2 D8.C D21.C R27.1
N$77: Q5.1(B) R11.2
N$78: C14.1 C148.+ U$37.RDF X3.2
N$79: C60.1 R43.1
N$80: QG1.3(OUT) U$1.8(MCLK)
N$81: C84.1 C149.1 L25.2 U$40.1(INA)
N$82: Q37.1(B) U$40.4(OUTA)
N$83: C78.1 C137.+ Q37.3(C) R258.2 U$40.8(VCC)
N$84: C194.1 U$40.5(OUTB)
N$85: C37.2 C38.1 C226.1 L14.1
N$86: IC4.2(A:-IN) R152.2 R153.1
N$87: IC2.2(A:-IN) R42.1 R43.2
N$88: C51.1 QG1.1(E/D)
N$89: IC2.6(B:-IN) R7.2 R48.2
N$90: C46.1 R162.2(W)
N$91: IC2.1(A:OUT) IC2.5(B:+IN) R42.2
N$92: C94.1 C152.+ IC2.3(A:+IN) R45.1 R46.1
N$93: C97.1 IC2.7(B:OUT) R48.1
N$94: C146.+ R7.1
N$95: C97.2 D6.C D7.A
N$96: Q5.2(E) R84.2
N$97: C92.2 Q80.3 R162.3(E2)
N$98: R28.1 R34.2 X2.3
N$99: R37.2 U$61.2 U$148.2
N$100: C103.1 C105.+ LM386M-1.5(OUT)
N$101: Q17.1(B) R141.1 R142.2 R144.2
N$102: C22.+ LM386M-1.1(GAIN)
N$103: C102.+ LM386M-1.7(BYPASS)
N$104: C103.2 R51.2
N$105: IC1.19(INTB) R136.1
N$106: R2.2 U$166.P$3
N$107: C107.1 C136.+ IC2.8(P:V+) R46.2 R56.2
N$108: C124.1 C133.2 R5.2 U$1.19(IOUT)
N$109: R36.2 U$166.P$5
N$110: R53.2 U$168.P$1
N$111: R54.2 U$168.P$3
N$112: R55.2 U$168.P$5
N$113: R89.1 U$143.4
N$114: R57.2 U$188.1 X9.1
N$115: C105.- R57.1 R58.1 X9.2
N$116: R58.2 U$188.4
N$117: C109.1 C126.+ LM386M-1.6(VS) R59.1
N$118: Q34.3(C) R225.2
N$119: C87.1 C135.+ L25.1 U$40.2(INB)
N$120: Q57.3(C) R70.1
N$121: Q7.1(B) R60.1 R61.2
N$122: C38.2 C40.1 C62.1 C226.2 L15.1
N$123: C205.1 CN222.2 R82.2
N$124: Q199.1(B) R62.2 R63.1
N$125: Q34.1(B) R71.2
N$126: Q57.1(B) R72.2
N$127: C118.1 C122.1 R182.2 U$72.VRF1 U$73.VRF2
N$128: C120.1 Q80.1 R16.2
N$129: C32.1 C46.2 Q38.3
N$130: C23.1 U$1.3(COMP)
N$131: C128.1 D13.C R83.2 R242.2
N$132: Q46.1(B) R164.1
N$133: D26.C LED1.A R85.1
N$134: R14.2 R40.2 R199.2 R251.2
N$135: C132.1 R79.1 R163.2(W)
N$136: C81.2 U$75.RFC
N$137: D12.C D13.A R88.1
N$138: C89.1 C125.1 C193.2
N$139: R90.1 U$143.1
N$140: Q204.3(C) R92.1 R255.1
N$141: RD16HHF1.3 U$37.GRF U$37.RDS
N$142: Q190.2(E) R91.2 R92.2 R255.2
N$143: C53.1 D4.A Q190.3(C) R66.2 R73.1 R93.2
N$144: Q197.1(B) R93.1
N$145: Q197.2(E) R101.1
N$146: R95.2 R101.2
N$147: C134.1 R95.1
N$148: C52.1 C53.2 R97.1
N$149: C77.1 R99.2 R263.1
N$150: Q204.1(B) R98.2
N$151: C108.2 L21.1
N$152: D10.C D19.C Q2.2 Q3.1 R25.1
N$153: L5.2 R87.2 R102.2 R103.2
N$154: C43.1 D23.C D24.C L5.1 TOROID2.P$1
N$155: D24.A D25.C
N$156: C76.1 D25.A L6.2
N$157: C75.1 D23.A L7.2
N$158: C28.1 L7.1 Q9.3(C)
N$159: C27.1 L6.1 Q10.3(C)
N$160: C101.2 C104.1 C106.1 C228.1 C233.2 L11.2 L12.1
N$161: C24.2 C29.1 U$46.4
N$162: Q9.1(B) R107.1 R108.2
N$163: Q10.1(B) R106.1 R109.2
N$164: Q100.3(C) R109.1
N$165: Q11.3(C) R108.1
N$166: Q12.3(C) Q100.1(B) R110.1
N$167: C30.2 C31.1 U$46.3
N$168: Q11.1(B) Q12.1(B) R111.2
N$169: C83.2 C86.1 L8.1
N$170: C86.2 C88.1 L9.1
N$171: C112.1 L21.2
N$172: C88.2 C95.1 C98.1 L10.1
N$173: C95.2 C98.2 C101.1 C233.1 L11.1
N$174: C112.2 C113.1 C116.1 L22.1
N$175: C33.2 C34.1 U$46.10
N$176: C43.2 C45.1 U$46.9
N$177: C116.2 C143.1 C144.1 C153.1 L26.1
N$178: Q13.1(B) R41.2 R112.1
N$179: Q14.1(B) R113.1 R114.1
N$180: Q42.3(C) R250.2
N$181: C40.2 C41.1 L17.1
N$182: C17.1 C41.2 C42.1 C44.1 C64.1 C67.1 L18.1
N$183: C121.1 U$72.RF2
N$184: C17.2 C44.2 C67.2 L18.2 R235.1 R236.1
N$185: C30.1 C33.1 TOROID1.P$1 TOROID2.P$2
N$186: C69.1 C71.1 C121.2 C227.1 C230.1 L20.2
N$187: C21.+ C39.1 IC3.8(P:V+) R167.1 R169.1
N$188: C18.2 U$73.RF2
N$189: C150.1 L29.2 L30.1
N$190: CN222.4 R220.3
N$191: L27.2 U$73.RF1
N$192: C133.1 L28.1
N$193: C182.1 R226.2 U$41.1(INA)
N$194: C68.1 C92.1 IC4.1(A:OUT) R152.1
N$195: C147.1 L28.2 L29.1
N$196: C184.1 C197.1 R196.1 R227.2 U$41.2(INB)
N$197: L31.1 XTAL8.1
N$198: C155.1 C224.1(E) Q8.1(B) R118.1 R120.2 XTAL8.2
N$199: C155.2 C156.1 C158.1 C204.1 C224.2(A) Q8.2(E) R119.2
N$200: C157.1 Q8.3(C) R120.1 R121.2
N$201: C158.2 Q36.3(G) R122.2
N$202: C159.1 Q36.1(D) R123.2
N$203: C160.1 L3.2 Q36.2(S)
N$204: C160.2 C161.1 C166.1 C167.1 L32.1
N$205: C162.1 C164.1 C165.1 C166.2 C167.2 C168.1 C169.1 L32.2 L33.1
N$206: Q22.1(B) R175.2
N$207: C185.+ R129.1
N$208: R196.2 R224.1
N$209: C212.1 R222.1 R253.1
N$210: IC5.2(A:-IN) R117.2
N$211: C77.2 C80.1 D17.C D22.C R31.2
N$212: C196.1 Q186.1 R150.2 R151.2
N$213: D5.C Q13.3(C) U$46.1
N$214: L19.1 U$75.RF2
N$215: C83.1 U$75.RF1
N$216: C188.1 U$40.6(OSCI)
N$217: C89.2 U$81.RF1
N$218: C144.2 U$76.RF1
N$219: C181.1 U$76.RFC
N$220: C90.2 U$81.RF2
N$221: C125.2 U$80.RF2
N$222: C174.2 U$80.RF1
N$223: IC1.20(INTA) R137.1
N$224: C90.1 C163.1 C168.2 C169.2 C174.1 L33.2
N$225: C181.2 C182.2 D27.A R125.2
N$226: Q23.1(B) R184.2
N$227: R117.1 R201.2 R256.2
N$228: C175.1 U$80.RFC
N$229: C176.1 U$81.RFC
N$230: L1.2 R125.1
N$231: C186.+ R128.1
N$232: R247.2 R252.1
N$233: C151.+ D7.C R11.1 R49.1 R241.1
N$234: Q28.3(C) R187.1 R188.1 R194.1
N$235: IC3.6(B:-IN) R156.1 R159.1
N$236: JS6.5 R23.1 U$61.1
N$237: IC1.15(A0) R130.1 R131.1
N$238: IC1.16(A1) R132.1 R133.1
N$239: IC1.17(A2) R134.1 R135.1
N$240: IC1.1(GPB0) X5.1
N$241: C96.+ C211.1 IC4.8(P:V+) R154.1 R195.1
N$242: Q27.1(B) R188.2
N$243: Q27.3(C) R189.1 R191.1
N$244: R165.1 R262.2
N$245: C198.+ R159.2
N$246: IC1.18(!RESET) R138.2 U$154.P$1
N$247: C195.2 R153.2
N$248: C54.2 R220.2
N$249: C202.1 Q200.3 R224.2
N$250: C203.1 Q200.1 R157.1 R158.1
N$251: C197.2 R257.2
N$252: R227.1 R228.3
N$253: IC3.7(B:OUT) R156.2 R257.1
N$254: C199.1 IC3.5(B:+IN) R161.2
N$255: IC3.1(A:OUT) R161.1 R166.2
N$256: R75.1 R119.1
N$257: R117.3 R200.1
N$258: C222.1 R221.2
N$259: IC3.2(A:-IN) R166.1 R221.1 R222.2 R253.2
N$260: C200.1 C201.+ IC3.3(A:+IN) R168.1 R169.2
N$261: R165.2 R261.1
N$262: Q22.3(C) R176.1 R178.1
N$263: D26.A R173.1
N$264: Q25.3(C) R179.1 R180.1 R182.1
N$265: Q24.1(B) R180.2
N$266: Q24.3(C) R181.1 R183.1
N$267: Q25.1(B) R185.2
N$268: R241.2 R254.1
N$269: C213.1 C214.+ IC5.8(P:V+) R198.1 R201.1 R256.1
N$270: IC1.2(GPB1) X5.2
N$271: IC1.3(GPB2) X5.3
N$272: IC1.4(GPB3) X5.4
N$273: IC1.5(GPB4) X5.5
N$274: IC1.6(GPB5) X5.6
N$275: IC1.7(GPB6) X5.7
N$276: IC1.8(GPB7) X5.8
N$277: Q28.1(B) R192.2
N$278: Q23.3(C) R174.1 R175.1 R177.1
N$279: CN222.8 R170.1
N$280: C99.2 R197.3
N$281: R115.1 R160.2
N$282: IC5.3(A:+IN) R202.1 R203.2 R204.2
N$283: R69.1 R225.1
N$284: C63.1 C65.1 L34.2
N$285: IC6.2(A:I1) IC6.4(B:O)
N$286: C223.2 R170.2
N$287: C217.+ IC6.1(A:I0) R206.2
N$288: C217.- R207.2 R208.2 U$245.2
N$289: Q21.1(B) R186.2 R214.1
N$290: C218.+ IC6.6(B:I1) R208.1
N$291: IC6.3(A:O) IC6.5(B:I0) IC6.8(C:I0) IC6.9(C:I1)
N$292: C215.1 C216.+ IC6.12(D:I0) IC6.13(D:I1) IC6.14(P:VDD) R205.2 R206.1 R207.1
N$293: Q20.1(B) R172.2 R211.1
N$294: Q32.3(C) R211.2
N$295: Q31.3(C) Q32.1(B) R212.2
N$296: Q31.1(B) R213.1
N$297: Q30.3(C) R214.2
N$298: Q30.1(B) R216.1
N$299: Q35.1 R171.1 R223.1
N$300: Q29.3(C) R213.2 R215.2 R216.2
N$301: Q29.1(B) R217.1 R218.1
N$302: Q20.3(C) R149.1
N$303: R260.1 R261.2
N$304: C212.2 C223.1 Q35.3
N$305: R228.2 R229.1
N$306: C18.1 R124.1 R236.2
N$307: C54.1 C222.2 Q16.3
N$308: Q16.1 R237.1 R238.1
N$309: C63.2 C65.2 R239.1
N$310: IC4.6(B:-IN) R190.2 R193.1
N$311: C187.1 Q37.2(E) R240.1
N$312: C68.2 R193.2
N$313: Q38.1 Q39.3 R243.2 R244.1
N$314: C66.+ Q39.1 Q40.3 R245.2 R247.1
N$315: Q40.1 R246.2 R248.1
N$316: R24.2 R25.2 R26.2 R27.2 R31.1 R68.2 R69.2 R70.2 R259.1
N$317: C24.1 C26.2 C127.1 TOROID1.P$2
N$318: C75.2 U$37.CLS
N$319: Q41.3(C) R173.2
N$320: R259.2 R260.2
N$321: R67.2 R78.2
N$323: C72.1 C73.1 C225.1 C234.1 C235.1 L23.2 L24.1
NARROW_A9: IC1.28(GPA7) R72.1
POWER_OUT: JS7.7 R83.1 R204.1
PSEL: JS5.1 R52.2 U$1.10(PSEL)
R20_PIN: IC5.6(B:-IN) IC5.7(B:OUT) R20.2 R219.2
RESET: JS5.5 U$1.11(RESET)
RESET_CK: JS2.1
RIT: C131.1 JS7.1 R79.2
S_METER: JS7.3 R49.2
SCL: IC1.12(SCL) JS7.11 R232.1
SCLK: JS5.9 U$1.14(SCLK)
SDA: IC1.13(SDA) JS7.9 R231.1
SDATA: JS5.7 U$1.13(SDATA)
SELECT_GREEN: IC1.21(GPA0) U$166.P$2
SELECT_RED: IC1.23(GPA2) U$166.P$6
SELECT_YELLOW: IC1.22(GPA1) U$166.P$4
SIDETONE: JS6.7 R98.1
SIDETONE_IN: C22.- C134.2 LM386M-1.8(GAIN)
SSB_PTT: CN222.6 R234.2
T: C110.1 C145.+ D2.A D3.A P1.P$1 Q7.3(C) R105.1 R111.1 R251.1
TD: C111.1 C142.+ D3.C R16.1 R18.1 R151.1
TX_IN_DAH: JS6.16 R76.1 R89.2
TX_IN_DIT: JS6.14 R77.2 R90.2
TX_OUT: JS5.10 R62.1 R184.1 R248.2 U$177.P$1
Unconnected: CN222.3 F1.FID F2.FID F3.FID F4.FID IC6.11(D:O) J1.2 J3.1(PIN1) JS5.4 JS5.6 JS5.8 JS5.12 JS5.13 JS5.14 JS6.1 JS6.3 JS7.8 JS7.12 R136.2 R137.2 U247.1 U247.2 U247.7 U247.8 U$1.2(REFOUT) U$1.16(SIGNBO) U$1.17(VIN) U$40.7(OSCO) U$41.4(OUTA) U$41.7(OSCO) U$46.5 U$46.8 U$143.2 U$143.3 U$188.2 U$188.3

## Notes on the sheet
- Set Bias current
- 40M TX Filter | +8.0v
- T | TD
- td
- Changed 1_24_14
- +12v_SW
- +5.0v
- +3.3v
- BAND_SELECT
- +3.3v | Key
- FUNCTION | lcd_rs
- 20M TX Filter | lcd_en
- lcd_d1
- lcd_d2
- lcd_d3
- +12V_SW | lcd_d4
- SELECT | tx_dit
- Power_Out
- tx_dah
- Code_Read
- rit | S_Meter
- Battery
- 40M | 20M | R20_PIN | CW_SPEED
- +3.3v
- Band_End_Flash_led
- DDS LP Filter
- CW_SSB
- SDA
- SCL
- BAND_SELECT
- DDS | Amp
- +8.0v
- Default 40M | +3.3v
- to RF_DET | +5.0v
- +12v_SW
- +12v
- fsync
- +8V
- sclk | +3.3v
- ALC_LED
- sdata
- POWER_OUT | reset
- psel | R20_PIN | select_green
- select_yellow
- fsel
- select_red
- MP_A
- MP_B
- Push-On | ALC_SET | MP_C
- SCL | SDA
- Push-Off | Medium_A8
- Narrow_A9
- ALC_FLASH
- TX/RX
- LO_DDS_1
- +5.0v
- when low setup for tx
- tx_out
- LO_DDS_2 | +8.0v
- I2C address
- CW
- +12v_SW
- +8.0v | +8v
- 9MHz L.O. & Filter
- CW_SSB
- AGC
- +8.0v
- 9MHz
- +8.0v
- 40 Meter RX Filter
- LINEOUT
- Lineout
- Null | TD
- NARROW
- to sidetone in
- Medium_A8
- Side Tone
- +8.0v
- MIXER2
- 20 Meter RX Filter
- CW | TD
- +8.0v | MIXER2P4
- from sidetone in
- jumper for spk
- +5.0v
- DDS_LO_MIC_MUTE
- +8.0V
- Band_select | Front panel TT logo
- Band_End_Flash_led
- 1. Line out
- RIT | P/N 78421
- 2. +8v
- 3. NC | S/A 82114
- 4. Line in
- SSB_PTT | mic | select_green | MP_A | RESET_CK
- 5. GND
- mic gnd
- LINEOUT | LINEIN | +3.3v
- 6. PTT
- select_yellow | MP_B | +5.0v
- TX_IN_DIT | 7. Mic GND
- +3.3v | Gnd
- 8. Mic | Gnd
- +12v_SW | select_red | MP_C
- TX_IN_DAH | Vin

## Library data of the parts
C1-C6 C8-C12 C14-C20 C23 C25 C27 C28 C32 C35-C42 C44 C46-C65 C67-C74 C76-C84 C86-C92 C94 C95 C97-C101 C103 C104 C106-C125 C127-C134 C143 C144 C147 C149 C150 C153-C184 C187 C188 C190-C197 C199 C200 C202-C213 C215 C219 C220 C222 C223 C225-C235 = mike:CAP
C7 C13 C21 C22 C66 C85 C93 C96 C102 C135-C142 C145 C146 C148 C151 C152 C185 C186 C189 C198 C201 C214 C216-C218 C221 = rcl:CPOL-US: POLARIZED CAPACITOR, American symbol
C24 C26 C29-C31 C33 C34 C43 C45 C75 = rcl:C-US: CAPACITOR, American symbol
C105 C126 = mike:CAP-POL
C224 = rcl:C-TRIMM: Trimm capacitor
CN222 = LeeJ:MT8
D1 D8-D11 D14 D17-D25 D27 = diode:DIODE-: DIODE
D2-D7 D12 D13 D26 = mike:MMSD914
F1-F4 = mike:FIDUCIAL
IC1 = microchip:MCP23017: http://ww1.microchip.com/downloads/en/DeviceDoc/21952a.pdf Source: http://ww1.microchip.com/downloads/en/DeviceDoc/21952a.pdf; MF: MICROCHIP; MPN: MCP23017-E/SO; OC_FARNELL: 1332087; OC_NEWARK: 31K2958
IC2-IC5 = linear:LM358: OP AMP also LM158; LM258; LM2904 Source: http://cache.national.com/ds/LM/LM158.pdf
IC6 = 40xx:4011: Quad 2-input NAND
J1 = con-jack:JACK-PLUG: DC POWER JACK Power Jack, DC, Right Angle, Through Hole, Rated 5A at 16VDC, PC Terminals Distributor: Farnell (www.Farnell.de) Drawing: 84N1161.pdf / 84N1162.pdf Manufacturer: SPC Technology (www.spctechnology.com) Type: SPC4077 / SPC 4078; OC_FARNELL: unknown; OC_NEWARK: unknown
J3 = mike:CONNECTOR-3
JS2 = con-samtec:SSW-106-02-S-S: THROUGH-HOLE .025" SQ POST SOCKET Source: Samtec SSW.pdf; MPN: SSW-106-02-S-S; OC_FARNELL: unknown; OC_NEWARK: 11P9416
JS5 JS6 = con-samtec:SSW-108-02-S-D: THROUGH-HOLE .025" SQ POST SOCKET Source: Samtec SSW.pdf; MPN: SSW-108-02-S-D; OC_FARNELL: unknown; OC_NEWARK: 85K7646
JS7 = con-samtec:SSW-106-02-S-D: THROUGH-HOLE .025" SQ POST SOCKET Source: Samtec SSW.pdf; MPN: SSW-106-02-S-D; OC_FARNELL: unknown; OC_NEWARK: 11P9414
L1-L34 = mike:INDUCTOR
LED1 = mike:LED
LM386M-1 = linear:LM386?-*: Low Voltage Audio Power Amplifier Source: http://cache.national.com/ds/LM/LM386.pdf
MNT1 MNT2 MNT6-MNT8 = mike:MOUNTINGHOLE
P1 U$154 U$177 U$184 = rebel_506:PAD
Q1-Q4 XTAL8 = crystal:CRYSTAL: CRYSTAL; OC_FARNELL: unknown; OC_NEWARK: unknown
Q5 Q6 Q8 Q11 Q12 Q14 Q15 Q17 Q18 Q22-Q25 Q27-Q32 Q34 Q37 Q42 Q46 Q57 Q100 Q103 Q190 Q197 Q199 Q204 = model506_Rebel:MMBT3904: MMBT3904
Q7 Q9 Q10 Q13 Q20 Q21 Q41 = mike:MMBT3906
Q16 Q26 Q35 Q38-Q40 Q80 Q186 Q200 = LeeJ:2N7002_2
Q36 = transistor-fet:?548*: N-Channel JFETs Source: VISHAY 2N5484.pdf Compatible: TO92 2N5245 J304 J305 U310 J308 J309 J310 TO72 2N4416 2N4416A 2N3823 2N4351 3N169 3N170 3N171 MFE3002 TO18 2N3796 2N3797 MFE825 Source: Motorola European Master Guide Pacge 3-59
QG1 = ethernetaudioboard_revd:CRYSTAL_SM77H: 3.3V CMOS Clock Oscillator Source: www.pletronics.com .. sm77h%203.3v.pdf
R1 R2 R4-R20 R22-R93 R95-R100 R102-R116 R118-R148 R150-R161 R164-R169 R171-R196 R198-R219 R221-R227 R229-R268 = mike:RESISTOR
R3 = resistor:R-US_: RESISTOR, American symbol
R21 R94 R101 R117 R149 R170 R197 R220 R228 = mike:RES-VAR
R162 R163 = pot:EVUE25POT: EVUE25 POT
RD16HHF1 = rebel_506:TO220S: RD_FET
TOROID1 TOROID2 = rebel_506:TOROID: toroid
U1 = mike:LM1117
U247 = IRF7319PbF:IRF7319PBF: IRF7319PbF power mosfet
U$1 = rebel_506:AD9834: AD9834
U$37 = rebel_506:OUT_TRI: out_tri
U$40 U$41 = rebel_506:SA612: SA612
U$46 = LeeJ:LEEJ_P2RELAY: Axicom P2 V23079 relay
U$61 U$148 U$245 = switch:TACT_SWITCH: TACT_SWITCH
U$72 U$73 U$75 U$76 U$80 U$81 = rebel_506:RF1200: RF1200 switch
U$143 U$188 = rebel_506:35252R: 35252R
U$166 U$168 = rebel_506:GYR_LED_TL: GYR_LED_TL
U$255 U$256 = LeeJ:BALUN: BALUN BIFILAR THRU-HOLE 21256, toroid core. (rotate core 90deg for 2-hole)
X1 = con-coax:?227161*: JACK, RIGHT ANGLE, 50 OHM, PCB, BNC Source: amp_227161.pdf; MF: TYCO ELECTRONICS; MPN: 1-227161; OC_FARNELL: unknown; OC_NEWARK: 33B3200
X2 = con-samtec:SSW-103-02-S-S: THROUGH-HOLE .025" SQ POST SOCKET Source: Samtec SSW.pdf; MPN: SSW-103-02-S-S; OC_FARNELL: unknown; OC_NEWARK: 11P9367
X3 X9 = con-samtec:SSW-101-02-S-D: THROUGH-HOLE .025" SQ POST SOCKET Source: Samtec SSW.pdf; MPN: SSW-101-02-S-D; OC_FARNELL: unknown; OC_NEWARK: 82P1456
X5 = con-samtec:SSW-108-02-S-S: THROUGH-HOLE .025" SQ POST SOCKET Source: Samtec SSW.pdf; MPN: SSW-108-02-S-S; OC_FARNELL: unknown; OC_NEWARK: 11P9448